# Altium schematic sheet 02.SchDoc
size 297 x 209 mm
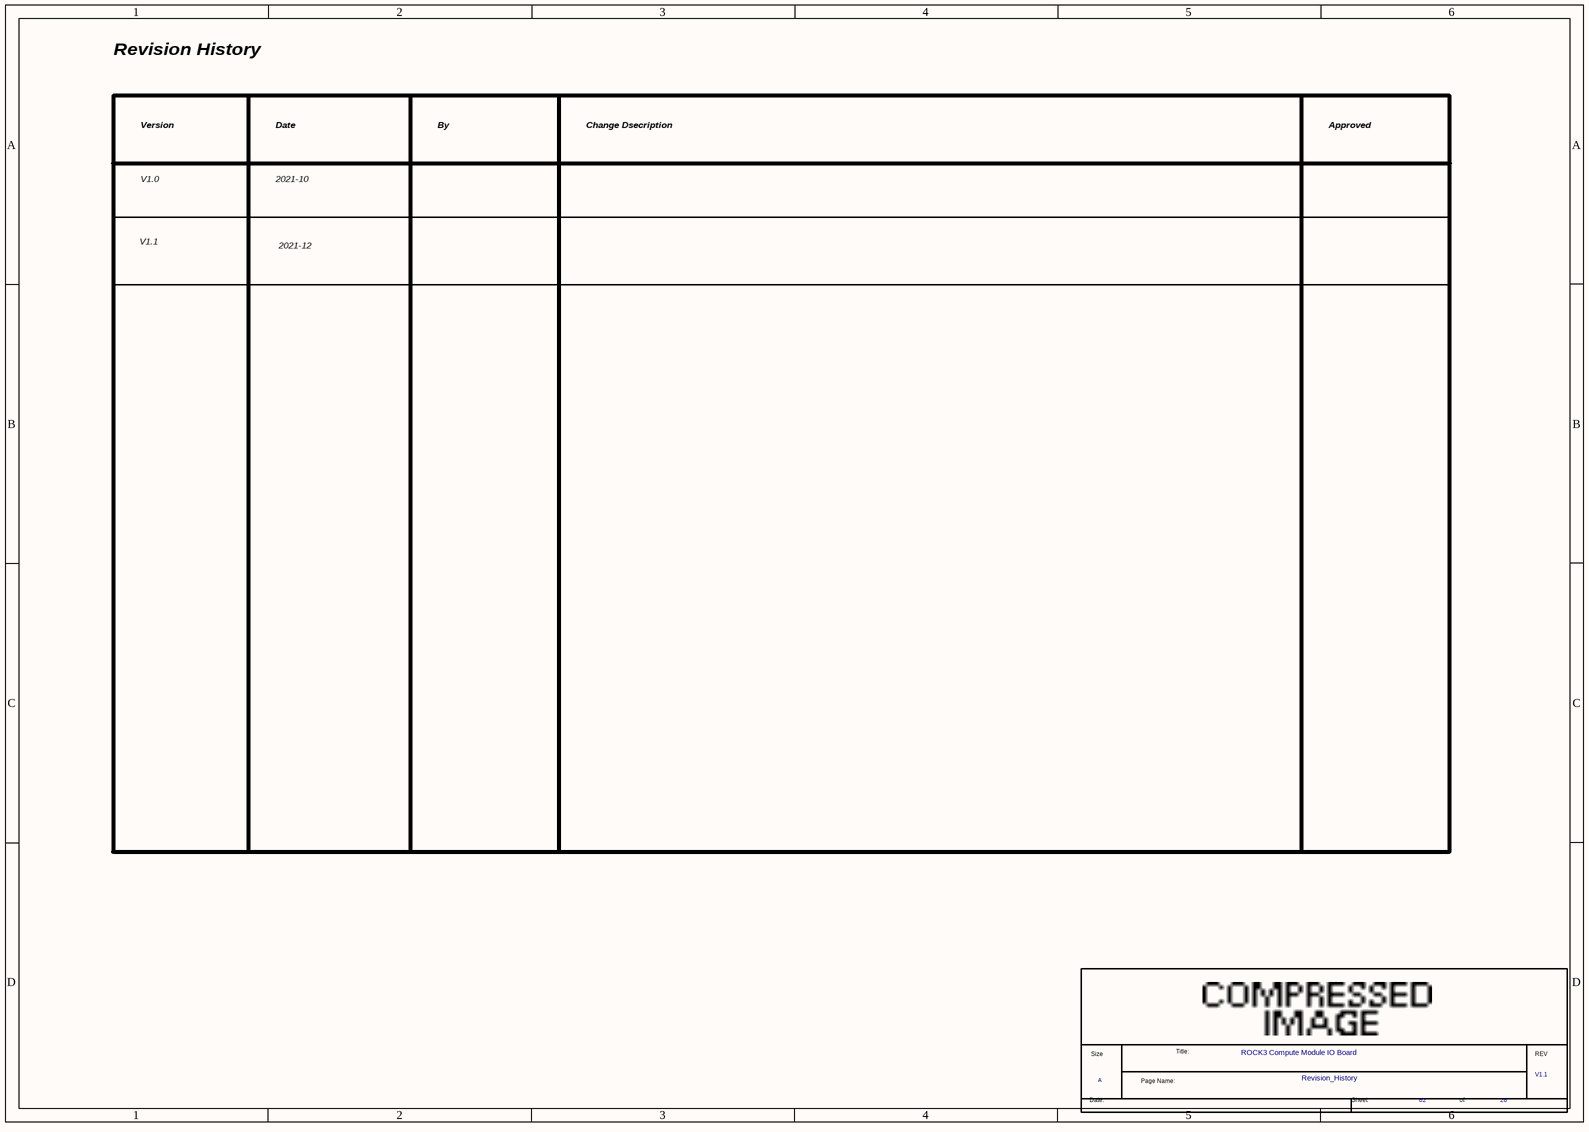
[diagram p0: 02.SchDoc]

## Parts
*  Page Count: 20  Page Number: 02  Page Size: A  Title: ROCK3 Compute Module IO Board  RevCode: V1.1  Doc: Revision_History  (hidden comment: radxa_gong)  (graphical)

## Notes on the sheet
- Revision History
- Version
- Date
- By
- Change Dsecription
- Approved
- V1.0
- 2021-10
- V1.1
- 2021-12
- (in symbol radxa_gong) Title:; Size; REV; Page Name:; Date:; Sheet; of

## Library data of the parts
* = radxa_gong: Page Create Date: March  8, 1995